# Altium schematic sheet PZEM-004T.SchDoc
size A; SheetNumber: 4; SheetTotal: 4
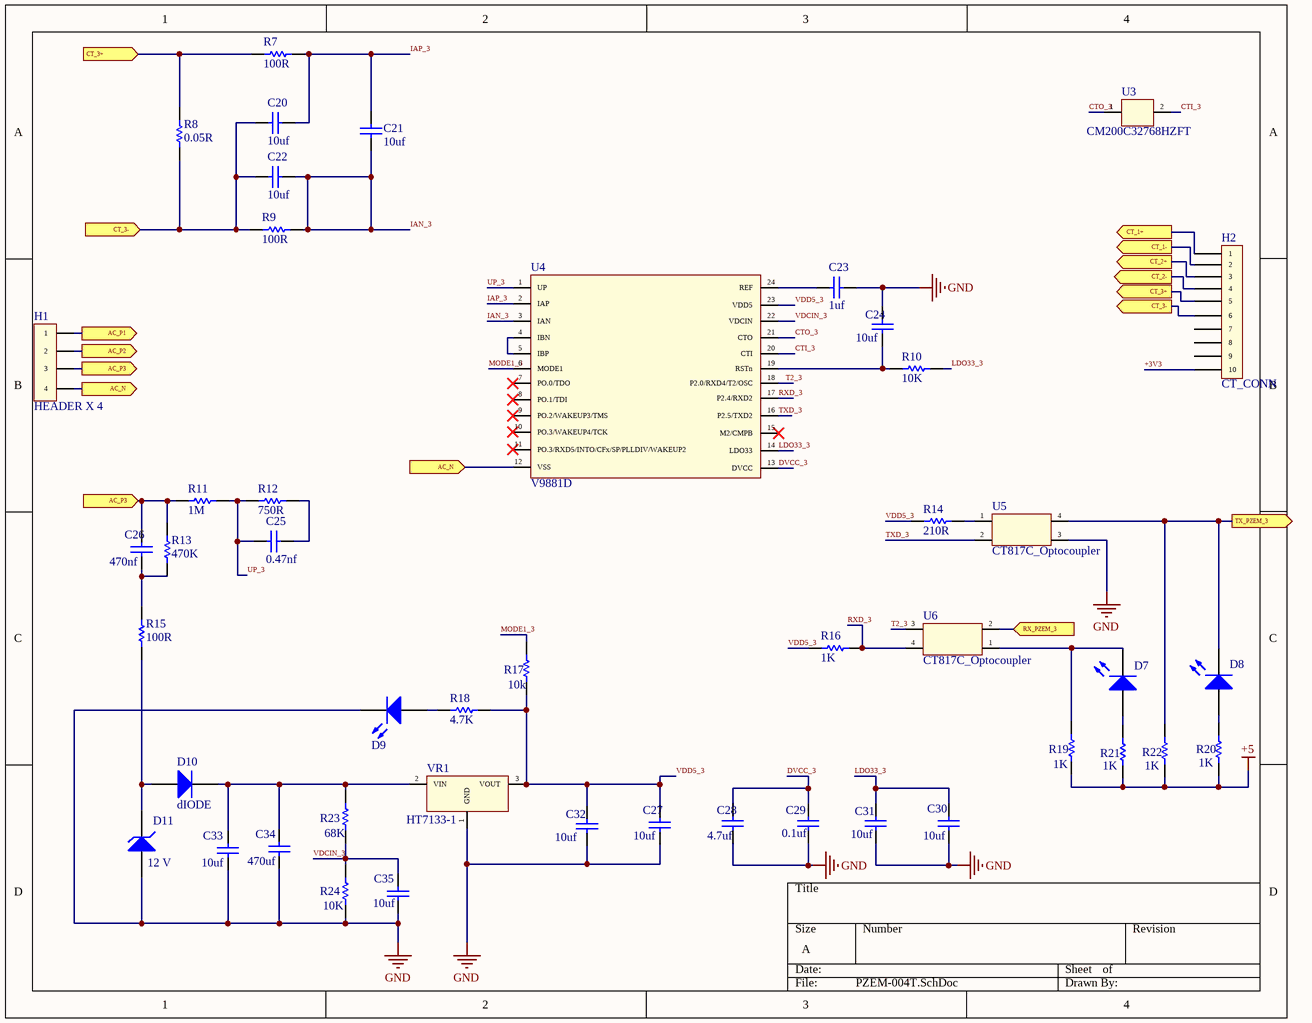
[diagram p0: PZEM-004T.SchDoc]

## Parts
C20  10uf  [CAPC1005X55N]
C21  10uf  [CAPC1005X55N]
C22  10uf  [CAPC1005X55N]
C23  1uf  [CAPC1005X55N]
C24  10uf  [CAPC1005X55N]
C25  0.47nf  [CAPRR1250W60L1530T500H1150]
C26  470nf  [CAPC1005X55N]
C27  10uf  [CAPC1005X55N]
C28  4.7uf  [CAPC1005X55N]
C29  0.1uf  [CAPC1005X55N]
C30  10uf  [CAPC1005X55N]
C31  10uf  [CAPC1005X55N]
C32  10uf  [CAPC1005X55N]
C33  10uf  [CAPC1005X55N]
C34  470uf  [CAPC1005X55N]
C35  10uf  [CAPC1005X55N]
D7  LED_  [WL-SMCW_0603_150060xx8x000]  (value not drawn)
D8  LED_  [WL-SMCW_0603_150060xx8x000]  (value not drawn)
D9  LED_  [WL-SMCW_0603_150060xx8x000]  (value not drawn)
D10  dIODE  [WL-SMCW_0603_150060xx8x000]
D11  12 V  [SMA_DIO-L]
H1  HEADER X 4  [PHOENIX_1757268]
H2  CT_CONN  [10 Pin terminal block]
R7  100R  [RESISTOR]
R8  0.05R  [RESAD700W45L350D185]
R9  100R  [RESISTOR]
R10  10K  [RESISTOR]
R11  1M  [RES_0603]
R12  750R  [RESISTOR]
R13  470K  [RESISTOR]
R14  210R  [RESISTOR]
R15  100R  [RESISTOR]
R16  1K  [RESISTOR]
R17  10k  [RESISTOR]
R18  4.7K  [RESISTOR]
R19  1K  [RESISTOR]
R20  1K  [RESISTOR]
R21  1K  [RESISTOR]
R22  1K  [RESISTOR]
R23  68K  [RESISTOR]
R24  10K  [RESISTOR]
U3  CM200C32768HZFT  [XTAL_CM8V-T1A-32.768KHZ-12.5PF-20PPM-TA-QA]
U4  V9881D  [SOP24 - duplicate]
U5  CT817C_Optocoupler  [SOP4]
U6  CT817C_Optocoupler  [SOP4]
VR1  HT7133-1  [SOP3]

## Ports
AC_N (in, see PZEM-004T[1B], PZEM_004T_2[2B], PZEM_004T_3[2B]), AC_N (out, see PZEM-004T[2B], PZEM_004T_2[2B], PZEM_004T_3[2B]), AC_P1 (out, see PZEM_004T_2[1B]), AC_P2 (out, see PZEM_004T_3[1B]), AC_P3 (in, see PZEM-004T[1B]), AC_P3 (out, see PZEM-004T[1B]), CT_1+ (out, see PZEM_004T_2[1A]), CT_1- (out, see PZEM_004T_2[1A]), CT_2+ (out, see PZEM_004T_3[1A]), CT_2- (out, see PZEM_004T_3[1A]), CT_3+ (in, see PZEM-004T[4B]), CT_3+ (out, see PZEM-004T[1A]), CT_3- (in, see PZEM-004T[4B]), CT_3- (out, see PZEM-004T[1A]), RX_PZEM_3 (in), TX_PZEM_3 (out)

## Nets
+5: R19.1 R20.1 R21.1 R22.1
GND: C23.2 C24.2 C27.1 C28.1 C29.1 C30.1 C31.1 C32.1 C33.1 C34.1 C35.1 D9.2(K) D11.1(A) R24.1 U5.3(EMITTER) VR1.1(GND)
+3V3: H2.10
AC_N: H1.4 U4.12(VSS) ; port AC_N
AC_P1: H1.1 ; port AC_P1
AC_P2: H1.2 ; port AC_P2
AC_P3: C26.2 H1.3 R11.1 R13.1 ; port AC_P3
CT_1+: H2.1 ; port CT_1+
CT_1-: H2.2 ; port CT_1-
CT_2+: H2.3 ; port CT_2+
CT_2-: H2.4 ; port CT_2-
CT_3+: H2.5 R7.2 R8.1 ; port CT_3+
CT_3-: C20.2 C22.2 H2.6 R8.2 R9.2 ; port CT_3-
CTI_3: U3.2 U4.20(CTI)
CTO_3: U3.1 U4.21(CTO)
DVCC_3: C28.2 C29.2 U4.13(DVCC)
IAN_3: C21.1 C22.1 R9.1 U4.3(IAN)
IAP_3: C20.1 C21.2 R7.1 U4.2(IAP)
LDO33_3: C30.2 C31.2 R10.2 U4.14(LDO33)
MODE1_3: R17.2 U4.6(MODE1)
RX_PZEM_3: U6.2(CATHODE) ; port RX_PZEM_3
RXD_3: R16.1 U4.17(P2.4/RXD2) U6.4(COLLECTOR)
T2_3: U4.18(P2.0/RXD4/T2/OSC) U6.3(EMITTER)
TX_PZEM_3: D8.2(K) R22.2 U5.4(COLLECTOR) ; port TX_PZEM_3
TXD_3: U4.16(P2.5/TXD2) U5.2(CATHODE)
UP_3: C25.2 R11.2 R12.1 U4.1(UP)
VDCIN_3: C35.2 R23.1 R24.2 U4.22(VDCIN)
VDD5_3: C27.2 C32.2 R14.2 R16.2 R17.1 R18.1 U4.23(VDD5) VR1.3(VOUT)
NetC23_1: C23.1 U4.24(REF)
NetC24_1: C24.1 R10.1 U4.19(RSTn)
NetC25_1: C25.1 R12.2
NetC26_1: C26.1 R13.2 R15.1
NetC33_2: C33.2 C34.2 D10.2(K) R23.2 VR1.2(VIN)
NetD7_1: D7.1(A) R21.2
NetD7_2: D7.2(K) R19.2 U6.1(ANODE)
NetD8_1: D8.1(A) R20.2
NetD9_1: D9.1(A) R18.2
NetD10_1: D10.1(A) D11.2(K) R15.2
NetR14_1: R14.1 U5.1(ANODE)
NetU4_4: U4.4(IBN) U4.5(IBP)

Not connected (* = marked no-connect by the designer): H2 7 8 9; U4 7(PO.0/TDO)* 8(PO.1/TDI)* 9(PO.2/WAKEUP3/TMS)* 10(PO.3/WAKEUP4/TCK)* 11(PO.3/RXD5/INTO/CFx/SP/PLLDIV/WAKEUP2)* 15(M2/CMPB)*

## Library data of the parts
C20-C35 = capacitor: CAP CER 10UF 6.3V X5R 0402; Manufacturer: Murata Electronics; Manufacturer Product Number: GRM155R60J106ME47D; Supplier: DigiKey; Supplier part number: 490-13239-1-ND
D7-D9 = LED_: LED GREEN CLEAR 0805 SMD; Manufacturer: Lumex Opto/Components Inc.; Manufacturer Product Number: SML-LX0805UPGC-TR; supplier: DigiKey; supplier product number: 67-1640-2-ND
D11 = ZENER: Zener Diode 12 V 1 W ±5% Surface Mount SMA; Manufacturer: Diodes Incorporated; Manufacturer Product Number: SMAZ12-13-F; supplier: DigiKey; supplier Product Number: SMAZ12-FDICT-ND
H1 = HEADER X 4: 4 X PIN HEADER FOR THE VOLTAGE CONNECTOR OF 3 PZEM
H2 = CT_CONN: 6 X PIN HEADER FOR THE CURRENT TRANSFORMER CONNECTIONS
R7-R24 = Resistor: RES 10K OHM 5% 1/4W 1206; Manufacturer: TE Connectivity Passive Product; Manufacturer Product Number: CRGCQ1206J10K; Supplier: DigiKey; Supplier part number: A130183CT-ND
U3 = CM200C32768HZFT: 32.768 kHz ±5ppm Crystal 12.5pF 50 kOhms 4-SOJ, 5.50mm pitch; Manufacturer: Citizen Finedevice Co Ltd; Manufacturer Product Number: CM200C32768HZFT; supplier: DigiKey; supplier Product Number: 300-8742-1-ND
U4 = V9881D: V9881D SSOP24 Three-phase Multifunctional Metering Chip Energy Metering V9881
U5 U6 = CT817C_Optocoupler: 35V 5kV 50mA 100mV@1mA,20mA 1 6V 1.24V DC SOP-4-2.54mm Transistor, Photovoltaic Output Optoisolators ROHS; Manufacturer: CT Micro International; Manufacturer product number: CT817C(SL)(T1)-H
VR1 = HT7133-1: Linear Voltage Regulator IC Positive Fixed 1 Output 100mA SOT-89-3; Manufacturer: UMW; Manufacturer Product Number: HT7133-1; supplier: DigiKey; supplier product number: 4518-HT7133-1CT-ND